# Altium schematic sheet IR-Decoder.SchDoc
size A
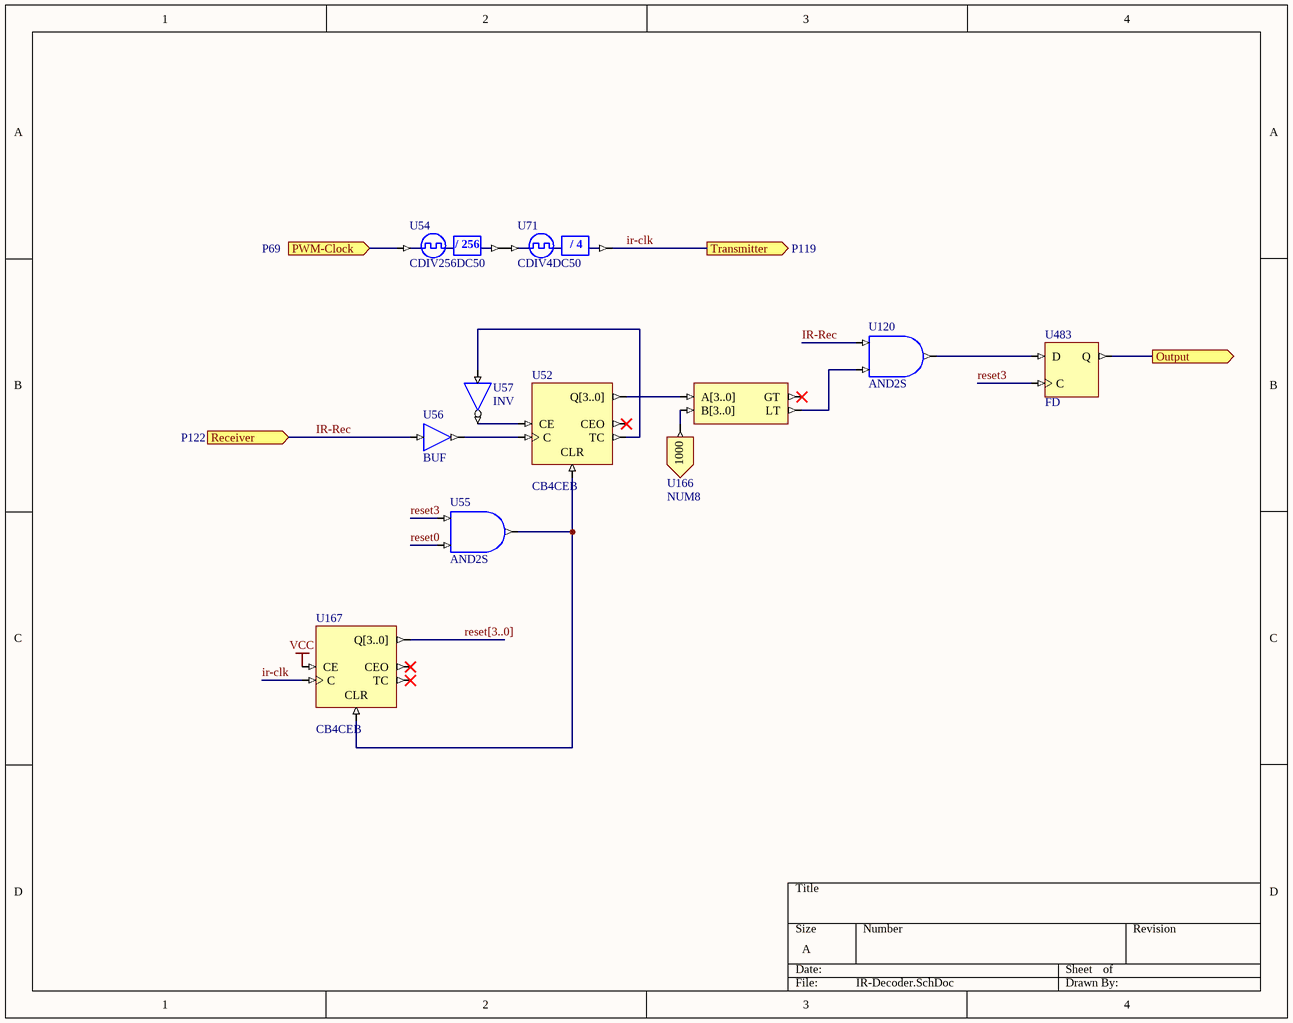
[diagram p0: IR-Decoder.SchDoc]

## Parts
U52  CB4CEB
U54  CDIV256DC50
U55  AND2S
U56  BUF
U57  INV
U71  CDIV4DC50
U120  AND2S
U165  COMPM4B  (value not drawn)
U166  NUM8
U167  CB4CEB
U483  FD

## Ports
Output (out), PWM-Clock (in, see P69), Receiver (in, see P122), Transmitter (out, see P119)

## Nets
VCC: U167.CE
ir-clk: U71.CLKDV U167.C ; port Transmitter
IR-Rec: U56.I U120.I0 ; port Receiver
Output: U483.Q ; port Output
PWM-Clock: U54.CLKIN ; port PWM-Clock
reset0: U55.I1
reset3: U55.I0 U483.C
reset[3..0]: U167.Q[3..0]
NetU52_C: U52.C U56.O
NetU52_CE: U52.CE U57.O
NetU52_CLR: U52.CLR U55.O U167.CLR
NetU52_Q[3..0]: U52.Q[3..0] U165.A[3..0]
NetU52_TC: U52.TC U57.I
NetU54_CLKDV: U54.CLKDV U71.CLKIN
NetU120_I1: U120.I1 U165.LT
NetU120_O: U120.O U483.D
NetU165_B[3..0]: U165.B[3..0] U166.O[3..0]

Not connected (* = marked no-connect by the designer): U52 CEO*; U165 GT*; U167 CEO* TC*

## Buses and harness runs
bus reset[3..0]

## Notes on the sheet
- (in symbol CDIV4DC50) / 4
- (in symbol CDIV256DC50) / 256
- (in symbol NUM8) 1000

## Library data of the parts
U52 U167 = CB4CEB: 4-Bit Cascadable Binary Counters with Clock Enable and Asynchronous Clear, Bus Version; ClockTrigger: Rising; Enable: High; PortSize: 4; ArchiveName: GENERIC; VHDLIB_SIM: GENERIC_LIB; Published: 29-Jan-2004; Publisher: Altium Limited; LastRevisionNo: 1.00.00; HelpURL: CR0118 FPGA Generic Library Guide.pdf#page=128; ComponentLink1URL: CR0130 FPGA Counter Resource Usage.pdf#page=13; ComponentLink1Description: Core &Resource Usage; FunctionalClass: Counter; SubClass: Binary; Reset: Asynchronous; PortType: Bus Version
U54 = CDIV256DC50: Clock Divider by 256 with 50% Duty Cycle Output; DivisorRate: 256; DutyCycle: 50; ArchiveName: GENERIC; VHDLIB_SIM: GENERIC_LIB; Published: 29-Jan-2004; Publisher: Altium Limited; LastRevisionNo: 1.00.00; HelpURL: CR0118 FPGA Generic Library Guide.pdf#page=143; ComponentLink1URL: CR0127 FPGA Clock Divider Resource Usage.pdf#page=31; ComponentLink1Description: Core &Resource Usage; FunctionalClass: Clock Divider
U55 U120 = AND2: 2-Input AND Gate, Single Pin Version; XilinxEquivalent: AND2; FunctionalClass: Logic Primitive; PortSize: 2; ArchiveName: GENERIC; VHDLIB_SIM: GENERIC_LIB; Published: 29-Jan-2004; Publisher: Altium Limited; LastRevisionNo: 1.00.00; HelpURL: CR0118 FPGA Generic Library Guide.pdf#page=114; ComponentLink1URL: CR0136 FPGA Logic Primitive Resource Usage.pdf#page=13; ComponentLink1Description: Core &Resource Usage; SubClass: AND; PortStyle: Single Pin Version
U56 = BUF: 1-bit General Purpose (Non-inverting) Buffer; ArchiveName: GENERIC; VHDLIB_SIM: GENERIC_LIB; Published: 29-Jan-2004; Publisher: Altium Limited; XilinxEquivalent: BUF; LastRevisionNo: 1.00.00; HelpURL: CR0118 FPGA Generic Library Guide.pdf#page=122; ComponentLink1URL: CR0125 FPGA Buffer Resource Usage.pdf#page=3; ComponentLink1Description: Core &Resource Usage; FunctionalClass: Buffer; SubClass: BUF
U57 = inv: Inverter; FunctionalClass: Logic Primitive; ArchiveName: GENERIC; VHDLIB_SIM: GENERIC_LIB; Published: 29-Jan-2004; Publisher: Altium Limited; XilinxEquivalent: INV; LastRevisionNo: 1.00.00; HelpURL: CR0118 FPGA Generic Library Guide.pdf#page=291; ComponentLink1URL: CR0136 FPGA Logic Primitive Resource Usage.pdf#page=61; ComponentLink1Description: Core &Resource Usage; SubClass: INV
U71 = CDIV4DC50: Clock Divider by 4 with 50% Duty Cycle Output; XilinxEquivalent: CLK_DIV4; DivisorRate: 4; DutyCycle: 50; ArchiveName: GENERIC; VHDLIB_SIM: GENERIC_LIB; Published: 29-Jan-2004; Publisher: Altium Limited; LastRevisionNo: 1.00.00; HelpURL: CR0118 FPGA Generic Library Guide.pdf#page=143; ComponentLink1URL: CR0127 FPGA Clock Divider Resource Usage.pdf#page=6; ComponentLink1Description: Core &Resource Usage; FunctionalClass: Clock Divider
U165 = COMPM4B: 4-Bit Magnitude Comparator, Bus Version; SubClass: COMPM; PortSize: 4; ArchiveName: GENERIC; VHDLIB_SIM: GENERIC_LIB; Published: 29-Jan-2004; Publisher: Altium Limited; LastRevisionNo: 1.00.00; HelpURL: CR0118 FPGA Generic Library Guide.pdf#page=153; ComponentLink1URL: CR0129 FPGA Comparator Resource Usage.pdf#page=29; ComponentLink1Description: Core &Resource Usage; FunctionalClass: Comparator; PortStyle: Bus Version
U166 = NUM8: Number Connector 8; FunctionalClass: Numeric Connector; SubClass: 8; PortSize: 4; PortStyle: Bus Version; ArchiveName: GENERIC; VHDLIB_SIM: GENERIC_LIB; Published: 29-Jan-2004; Publisher: Altium Limited; LastRevisionNo: 1.00.00; HelpURL: CR0118 FPGA Generic Library Guide.pdf#page=409; ComponentLink1URL: CR0138 FPGA Numeric Connector Resource Usage.pdf#page=10; ComponentLink1Description: Core &Resource Usage
U483 = FD: D-Type Flip-Flop; ClockTrigger: Rising; ArchiveName: GENERIC; VHDLIB_SIM: GENERIC_LIB; Published: 29-Jan-2004; Publisher: Altium Limited; XilinxEquivalent: FD; LastRevisionNo: 1.00.00; HelpURL: CR0118 FPGA Generic Library Guide.pdf#page=170; ComponentLink1URL: CR0133 FPGA Flip Flop Resource Usage.pdf#page=4; ComponentLink1Description: Core &Resource Usage; FunctionalClass: Flip-Flop; SubClass: FD